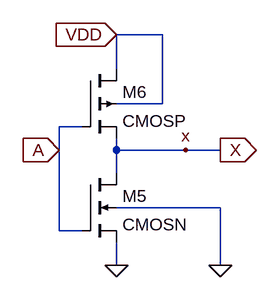
[diagram p0: schematic Inversor1mA.asc]
Inversor1mA.asc, the LTspice schematic file:
Version 4
SHEET 1 1388 680
WIRE 368 16 304 16
WIRE 304 64 304 16
WIRE 368 112 368 16
WIRE 368 112 304 112
WIRE 256 144 224 144
WIRE 224 176 224 144
WIRE 304 176 304 160
WIRE 400 176 304 176
WIRE 448 176 400 176
WIRE 304 208 304 176
WIRE 448 256 304 256
WIRE 224 288 224 176
WIRE 256 288 224 288
WIRE 304 336 304 304
WIRE 448 336 448 256
FLAG 304 336 0
FLAG 448 336 0
FLAG 224 176 A
IOPIN 224 176 In
FLAG 400 176 x
FLAG 448 176 X
IOPIN 448 176 Out
FLAG 304 16 VDD
IOPIN 304 16 In
SYMBOL nmos4 256 208 R0
SYMATTR InstName M5
SYMATTR Value CMOSN
SYMATTR Value2 l=0.6u w=4.2u
SYMBOL pmos4 256 64 R0
SYMATTR InstName M6
SYMATTR Value CMOSP
SYMATTR Value2 l=.6u w=14u

The netlist it stands for:
* Inversor1mA.asc
M5 x A 0 0 CMOSN l=0.6u w=4.2u
M6 VDD A x VDD CMOSP l=.6u w=14u
.model NMOS NMOS
.model PMOS PMOS
.lib standard.mos
.backanno
.end